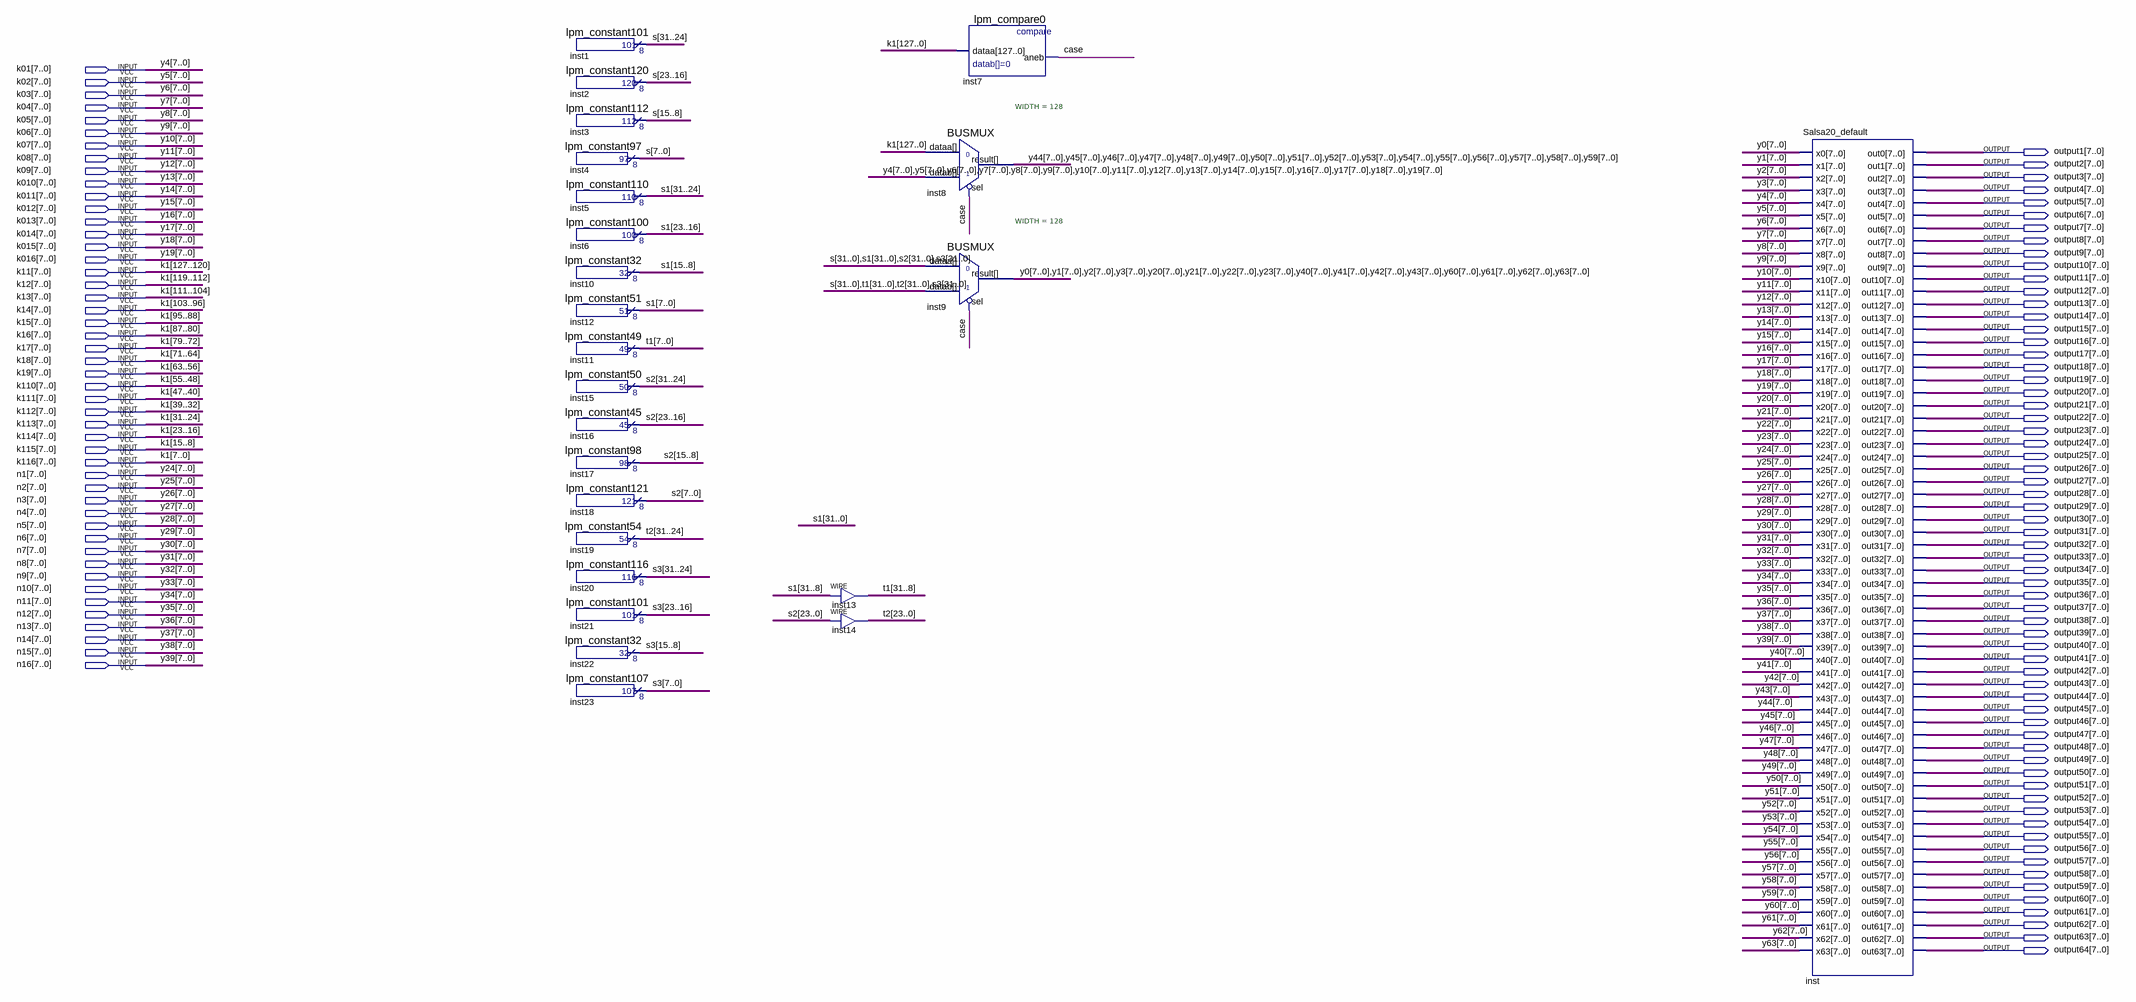
[diagram p0: schematic sheet]
// Quartus schematic Salsa20_exp.bdf as structural Verilog: 24 symbols, 112 pins
module Salsa20_exp (
  input  [7:0] k01,
  input  [7:0] k02,
  input  [7:0] k03,
  input  [7:0] k04,
  input  [7:0] k05,
  input  [7:0] k06,
  input  [7:0] k07,
  input  [7:0] k08,
  input  [7:0] k09,
  input  [7:0] k010,
  input  [7:0] k011,
  input  [7:0] k012,
  input  [7:0] k013,
  input  [7:0] k014,
  input  [7:0] k015,
  input  [7:0] k016,
  input  [7:0] k11,
  input  [7:0] k12,
  input  [7:0] k13,
  input  [7:0] k14,
  input  [7:0] k15,
  input  [7:0] k16,
  input  [7:0] k17,
  input  [7:0] k18,
  input  [7:0] k19,
  input  [7:0] k110,
  input  [7:0] k111,
  input  [7:0] k112,
  input  [7:0] k113,
  input  [7:0] k114,
  input  [7:0] k115,
  input  [7:0] k116,
  input  [7:0] n1,
  input  [7:0] n2,
  input  [7:0] n3,
  input  [7:0] n4,
  input  [7:0] n5,
  input  [7:0] n6,
  input  [7:0] n7,
  input  [7:0] n8,
  input  [7:0] n9,
  input  [7:0] n10,
  input  [7:0] n11,
  input  [7:0] n12,
  input  [7:0] n13,
  input  [7:0] n14,
  input  [7:0] n15,
  input  [7:0] n16,
  output [7:0] output1,
  output [7:0] output2,
  output [7:0] output3,
  output [7:0] output4,
  output [7:0] output5,
  output [7:0] output6,
  output [7:0] output7,
  output [7:0] output8,
  output [7:0] output9,
  output [7:0] output10,
  output [7:0] output11,
  output [7:0] output12,
  output [7:0] output13,
  output [7:0] output14,
  output [7:0] output15,
  output [7:0] output16,
  output [7:0] output17,
  output [7:0] output18,
  output [7:0] output19,
  output [7:0] output20,
  output [7:0] output21,
  output [7:0] output22,
  output [7:0] output23,
  output [7:0] output24,
  output [7:0] output25,
  output [7:0] output26,
  output [7:0] output27,
  output [7:0] output28,
  output [7:0] output29,
  output [7:0] output30,
  output [7:0] output31,
  output [7:0] output32,
  output [7:0] output33,
  output [7:0] output34,
  output [7:0] output35,
  output [7:0] output36,
  output [7:0] output37,
  output [7:0] output38,
  output [7:0] output39,
  output [7:0] output40,
  output [7:0] output41,
  output [7:0] output42,
  output [7:0] output43,
  output [7:0] output44,
  output [7:0] output45,
  output [7:0] output46,
  output [7:0] output47,
  output [7:0] output48,
  output [7:0] output49,
  output [7:0] output50,
  output [7:0] output51,
  output [7:0] output52,
  output [7:0] output53,
  output [7:0] output54,
  output [7:0] output55,
  output [7:0] output56,
  output [7:0] output57,
  output [7:0] output58,
  output [7:0] output59,
  output [7:0] output60,
  output [7:0] output61,
  output [7:0] output62,
  output [7:0] output63,
  output [7:0] output64
);

  wire \case ;
  wire [7:0] y0, y1, y2, y3, y20, y21, y22, y23, y40, y41, y42, y43, y44, y45, y46, y47, y48, y49, y50, y51,
       y52, y53, y54, y55, y56, y57, y58, y59, y60, y61, y62, y63;
  wire [31:0] s, s1, s2, s3, t1, t2;

  lpm_constant101 inst1 (.result(s[31:24]));
  lpm_constant120 inst2 (.result(s[23:16]));
  lpm_constant112 inst3 (.result(s[15:8]));
  lpm_constant97 inst4 (.result(s[7:0]));
  lpm_constant110 inst5 (.result(s1[31:24]));
  lpm_constant100 inst6 (.result(s1[23:16]));
  lpm_constant32 inst10 (.result(s1[15:8]));
  lpm_constant51 inst12 (.result(s1[7:0]));
  lpm_constant49 inst11 (.result(t1[7:0]));
  lpm_constant50 inst15 (.result(s2[31:24]));
  lpm_constant45 inst16 (.result(s2[23:16]));
  lpm_constant98 inst17 (.result(s2[15:8]));
  lpm_constant121 inst18 (.result(s2[7:0]));
  lpm_constant54 inst19 (.result(t2[31:24]));
  lpm_constant116 inst20 (.result(s3[31:24]));
  lpm_constant101 inst21 (.result(s3[23:16]));
  lpm_constant32 inst22 (.result(s3[15:8]));
  lpm_constant107 inst23 (.result(s3[7:0]));
  assign t1[31:8] = s1[31:8];  // WIRE inst13
  assign t2[23:0] = s2[23:0];  // WIRE inst14
  BUSMUX #(.WIDTH(128)) inst8 (
    .datab({k01, k02, k03, k04, k05, k06, k07, k08, k09, k010, k011, k012, k013, k014, k015, k016}),
    .sel(~\case ),
    .dataa({k11, k12, k13, k14, k15, k16, k17, k18, k19, k110, k111, k112, k113, k114, k115, k116}),
    .result({y44, y45, y46, y47, y48, y49, y50, y51, y52, y53, y54, y55, y56, y57, y58, y59}));
  BUSMUX #(.WIDTH(128)) inst9 (
    .datab({s, t1, t2, s3}), .sel(~\case ), .dataa({s, s1, s2, s3}),
    .result({y0, y1, y2, y3, y20, y21, y22, y23, y40, y41, y42, y43, y60, y61, y62, y63}));
  lpm_compare0 inst7 (
    .dataa({k11, k12, k13, k14, k15, k16, k17, k18, k19, k110, k111, k112, k113, k114, k115, k116}),
    .aneb(\case ));
  Salsa20_default inst (
    .x0(y0), .x1(y1), .x2(y2), .x3(y3), .x4(k01), .x5(k02), .x6(k03), .x7(k04), .x8(k05), .x9(k06),
    .x10(k07), .x11(k08), .x12(k09), .x13(k010), .x14(k011), .x15(k012), .x16(k013), .x17(k014), .x18(k015),
    .x19(k016), .x20(y20), .x21(y21), .x22(y22), .x23(y23), .x24(n1), .x25(n2), .x26(n3), .x27(n4), .x28(n5),
    .x29(n6), .x30(n7), .x31(n8), .x32(n9), .x33(n10), .x34(n11), .x35(n12), .x36(n13), .x37(n14), .x38(n15),
    .x39(n16), .x40(y40), .x41(y41), .x42(y42), .x43(y43), .x44(y44), .x45(y45), .x46(y46), .x47(y47),
    .x48(y48), .x49(y49), .x50(y50), .x51(y51), .x52(y52), .x53(y53), .x54(y54), .x55(y55), .x56(y56),
    .x57(y57), .x58(y58), .x59(y59), .x60(y60), .x61(y61), .x62(y62), .x63(y63), .out0(output1),
    .out1(output2), .out2(output3), .out3(output4), .out4(output5), .out5(output6), .out6(output7),
    .out7(output8), .out8(output9), .out9(output10), .out10(output11), .out11(output12), .out12(output13),
    .out13(output14), .out14(output15), .out15(output16), .out16(output17), .out17(output18),
    .out18(output19), .out19(output20), .out20(output21), .out21(output22), .out22(output23),
    .out23(output24), .out24(output25), .out25(output26), .out26(output27), .out27(output28),
    .out28(output29), .out29(output30), .out30(output31), .out31(output32), .out32(output33),
    .out33(output34), .out34(output35), .out35(output36), .out36(output37), .out37(output38),
    .out38(output39), .out39(output40), .out40(output41), .out41(output42), .out42(output43),
    .out43(output44), .out44(output45), .out45(output46), .out46(output47), .out47(output48),
    .out48(output49), .out49(output50), .out50(output51), .out51(output52), .out52(output53),
    .out53(output54), .out54(output55), .out55(output56), .out56(output57), .out57(output58),
    .out58(output59), .out59(output60), .out60(output61), .out61(output62), .out62(output63), .out63(output64));

  // Other names for the same wires on the sheet: k1[127:0] = {k11, k12, k13, k14, k15, k16, k17, k18, k19, k110, k111, k112, k113, k114, k115, k116};
  //   y4[7:0] = k01; y5[7:0] = k02; y6[7:0] = k03; y7[7:0] = k04; y8[7:0] = k05; y9[7:0] = k06; y10[7:0] = k07;
  //   y11[7:0] = k08; y12[7:0] = k09; y13[7:0] = k010; y14[7:0] = k011; y15[7:0] = k012; y16[7:0] = k013;
  //   y17[7:0] = k014; y18[7:0] = k015; y19[7:0] = k016; y24[7:0] = n1; y25[7:0] = n2; y26[7:0] = n3; y27[7:0] = n4;
  //   y28[7:0] = n5; y29[7:0] = n6; y30[7:0] = n7; y31[7:0] = n8; y32[7:0] = n9; y33[7:0] = n10; y34[7:0] = n11;
  //   y35[7:0] = n12; y36[7:0] = n13; y37[7:0] = n14; y38[7:0] = n15; y39[7:0] = n16
endmodule
